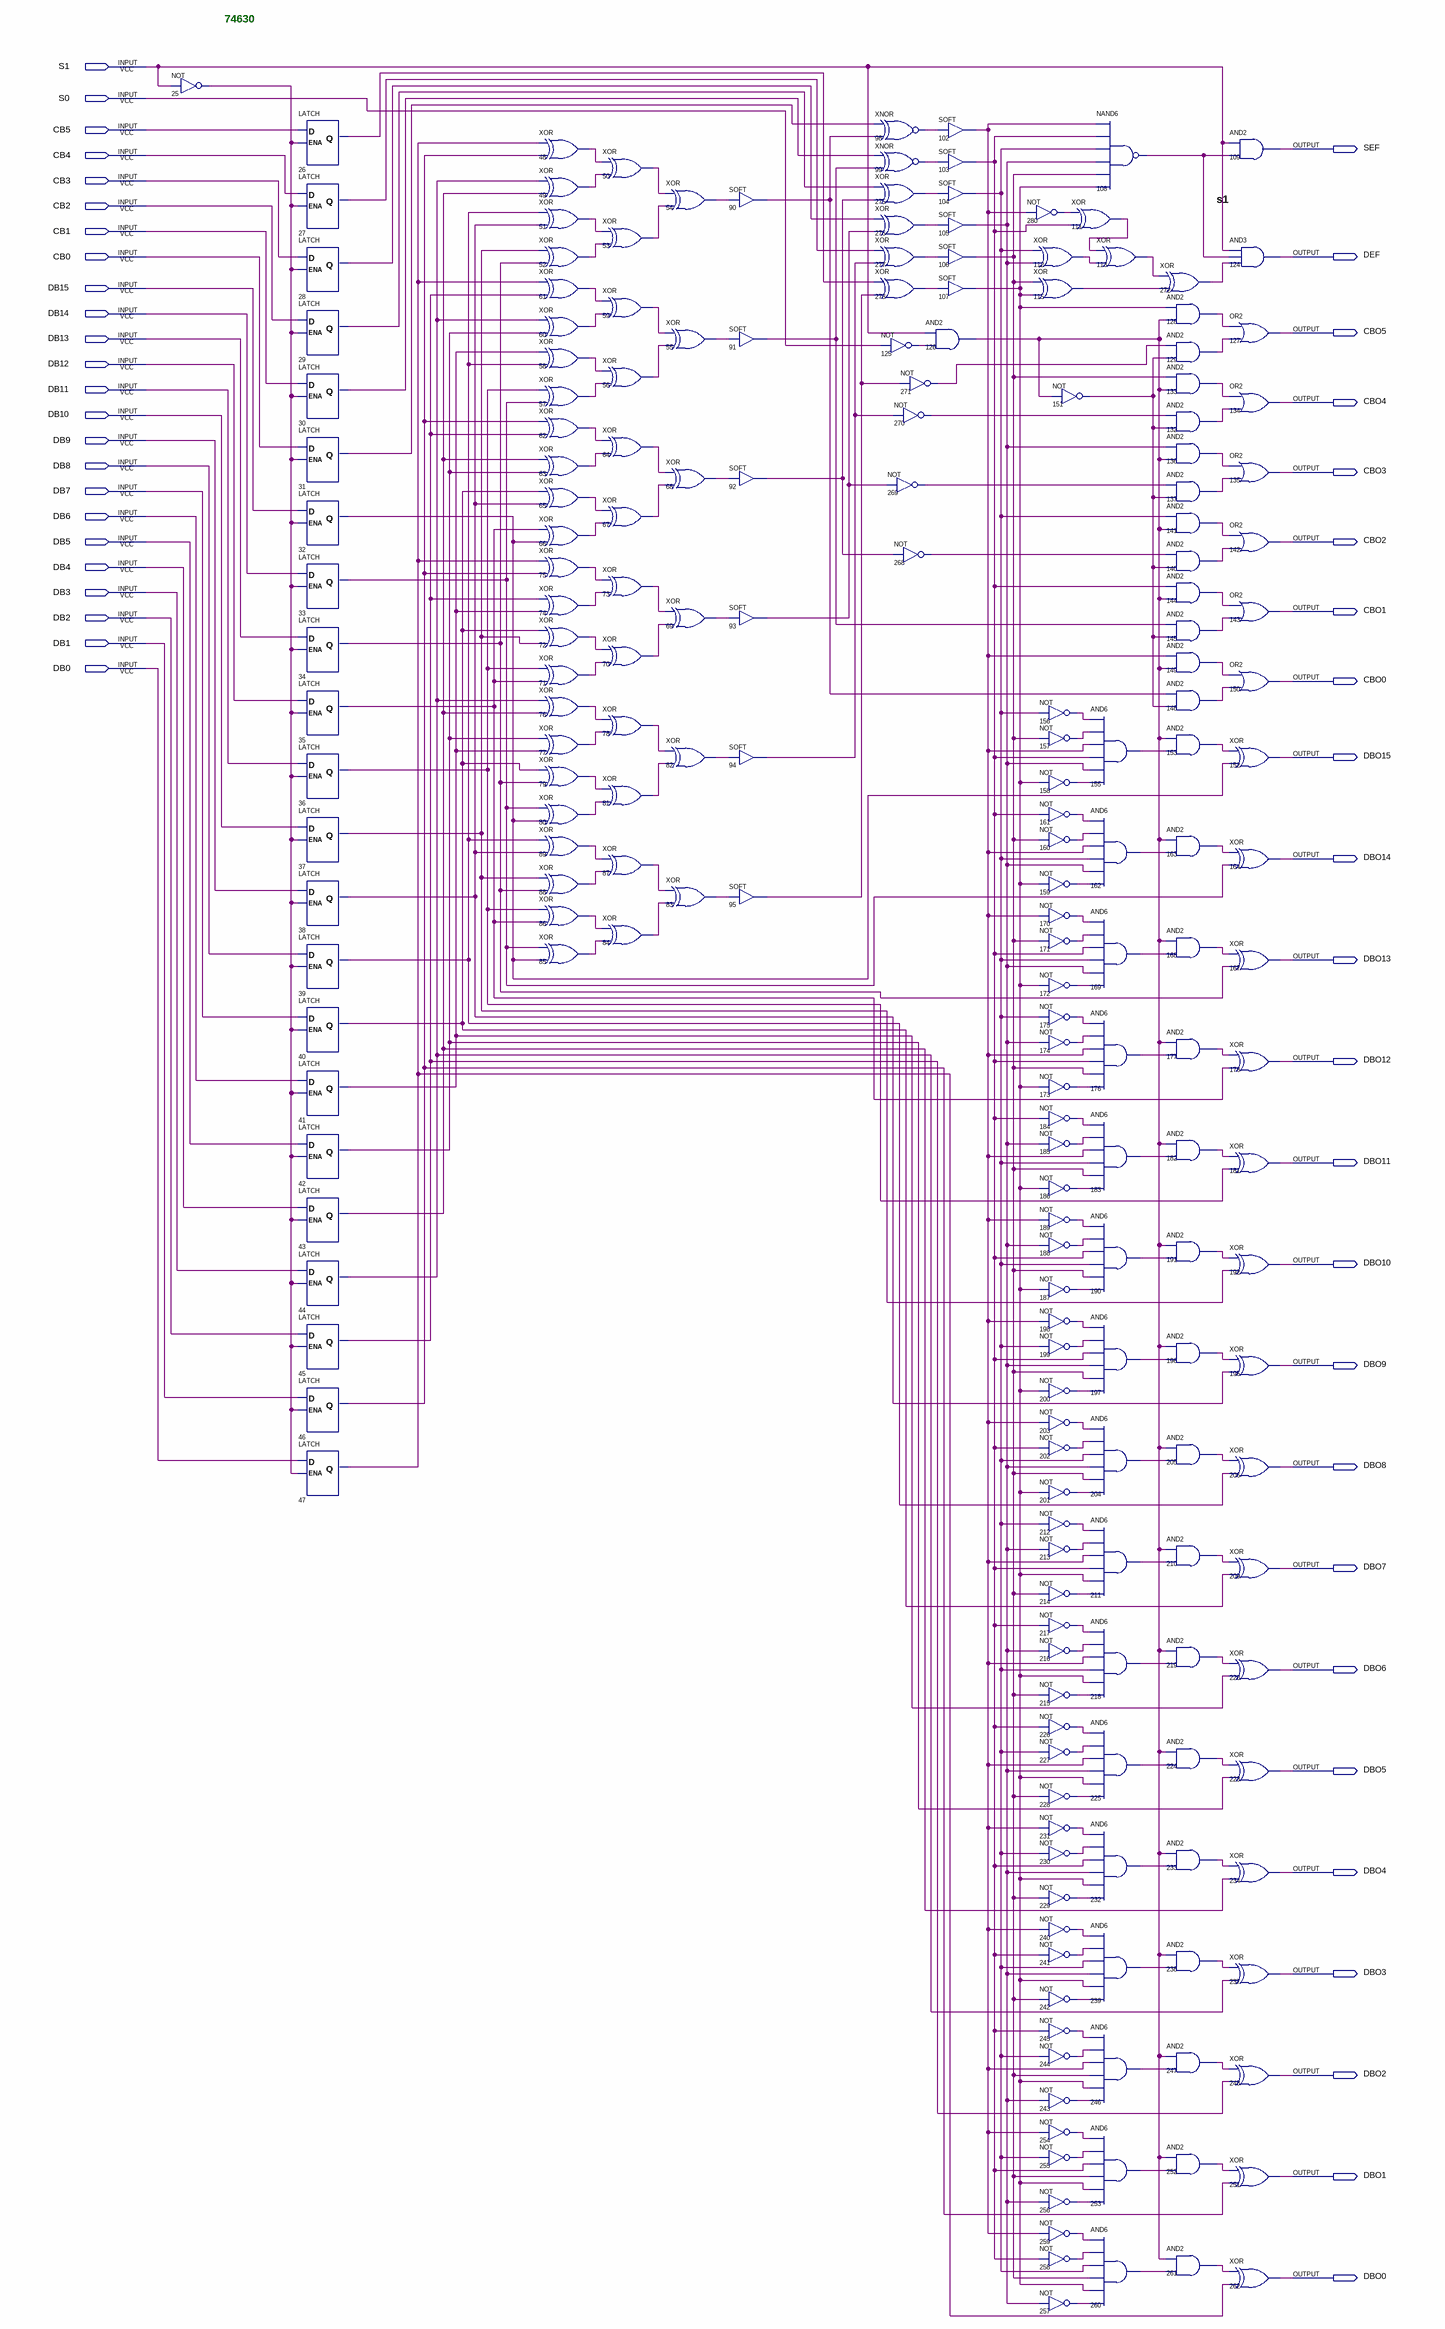
[diagram p0: schematic sheet]
// Quartus schematic 74630.bdf as structural Verilog: 213 symbols, 48 pins
module \74630  (
  input  S1,
  input  S0,
  input  CB5,
  input  CB4,
  input  CB3,
  input  CB2,
  input  CB1,
  input  CB0,
  input  DB15,
  input  DB14,
  input  DB13,
  input  DB12,
  input  DB11,
  input  DB10,
  input  DB9,
  input  DB8,
  input  DB7,
  input  DB6,
  input  DB5,
  input  DB4,
  input  DB3,
  input  DB2,
  input  DB1,
  input  DB0,
  output SEF,
  output DEF,
  output CBO5,
  output CBO4,
  output CBO3,
  output CBO2,
  output CBO1,
  output CBO0,
  output DBO15,
  output DBO14,
  output DBO13,
  output DBO12,
  output DBO11,
  output DBO10,
  output DBO9,
  output DBO8,
  output DBO7,
  output DBO6,
  output DBO5,
  output DBO4,
  output DBO3,
  output DBO2,
  output DBO1,
  output DBO0
);

  wire n25_out, n26_q, n27_q, n28_q, n29_q, n30_q, n31_q, n32_q, n33_q, n34_q, n35_q, n36_q, n37_q, n38_q,
       n39_q, n40_q, n41_q, n42_q, n43_q, n44_q, n45_q, n46_q, n47_q, n48_out, n49_out, n50_out, n51_out,
       n52_out, n53_out, n54_out, n55_out, n56_out, n57_out, n58_out, n59_out, n60_out, n61_out, n62_out,
       n63_out, n64_out, n65_out, n66_out, n67_out, n68_out, n69_out, n70_out, n71_out, n72_out, n73_out,
       n74_out, n75_out, n76_out, n77_out, n78_out, n79_out, n80_out, n81_out, n82_out, n83_out, n84_out,
       n85_out, n86_out, n87_out, n88_out, n89_out, n90_out, n91_out, n92_out, n93_out, n94_out, n95_out,
       n98_out, n99_out, n102_out, n103_out, n104_out, n105_out, n106_out, n107_out, n108_out, n111_out,
       n112_out, n113_out, n115_out, n125_out, n126_out, n128_out, n129_out, n132_out, n133_out, n136_out,
       n137_out, n140_out, n141_out, n144_out, n145_out, n148_out, n149_out, n151_out, n153_out, n155_out,
       n156_out, n157_out, n158_out, n159_out, n160_out, n161_out, n162_out, n163_out, n168_out, n169_out,
       n170_out, n171_out, n172_out, n173_out, n174_out, n175_out, n176_out, n177_out, n182_out, n183_out,
       n184_out, n185_out, n186_out, n187_out, n188_out, n189_out, n190_out, n191_out, n196_out, n197_out,
       n198_out, n199_out, n200_out, n201_out, n202_out, n203_out, n204_out, n205_out, n210_out, n211_out,
       n212_out, n213_out, n214_out, n215_out, n216_out, n217_out, n218_out, n219_out, n224_out, n225_out,
       n226_out, n227_out, n228_out, n229_out, n230_out, n231_out, n232_out, n233_out, n238_out, n239_out,
       n240_out, n241_out, n242_out, n243_out, n244_out, n245_out, n246_out, n247_out, n252_out, n253_out,
       n254_out, n255_out, n256_out, n257_out, n258_out, n259_out, n260_out, n261_out, n268_out, n269_out,
       n270_out, n271_out, n272_out, n275_out, n276_out, n277_out, n278_out, n280_out;

  not u_25 (n25_out, S1);
  LATCH u_26 (.D(CB5), .ENA(n25_out), .Q(n26_q));
  LATCH u_27 (.D(CB4), .ENA(n25_out), .Q(n27_q));
  LATCH u_28 (.D(CB3), .ENA(n25_out), .Q(n28_q));
  LATCH u_29 (.D(CB2), .ENA(n25_out), .Q(n29_q));
  LATCH u_30 (.D(CB1), .ENA(n25_out), .Q(n30_q));
  LATCH u_31 (.D(CB0), .ENA(n25_out), .Q(n31_q));
  LATCH u_32 (.D(DB15), .ENA(n25_out), .Q(n32_q));
  LATCH u_33 (.D(DB14), .ENA(n25_out), .Q(n33_q));
  LATCH u_34 (.D(DB13), .ENA(n25_out), .Q(n34_q));
  LATCH u_35 (.D(DB12), .ENA(n25_out), .Q(n35_q));
  LATCH u_36 (.D(DB11), .ENA(n25_out), .Q(n36_q));
  LATCH u_37 (.D(DB10), .ENA(n25_out), .Q(n37_q));
  LATCH u_38 (.D(DB9), .ENA(n25_out), .Q(n38_q));
  LATCH u_39 (.D(DB8), .ENA(n25_out), .Q(n39_q));
  LATCH u_40 (.D(DB7), .ENA(n25_out), .Q(n40_q));
  LATCH u_41 (.D(DB6), .ENA(n25_out), .Q(n41_q));
  LATCH u_42 (.D(DB5), .ENA(n25_out), .Q(n42_q));
  LATCH u_43 (.D(DB4), .ENA(n25_out), .Q(n43_q));
  LATCH u_44 (.D(DB3), .ENA(n25_out), .Q(n44_q));
  LATCH u_45 (.D(DB2), .ENA(n25_out), .Q(n45_q));
  LATCH u_46 (.D(DB1), .ENA(n25_out), .Q(n46_q));
  LATCH u_47 (.D(DB0), .ENA(n25_out), .Q(n47_q));
  xor u_48 (n48_out, n47_q, n46_q);
  xor u_49 (n49_out, n44_q, n43_q);
  xor u_51 (n51_out, n39_q, n38_q);
  xor u_52 (n52_out, n37_q, n34_q);
  xor u_61 (n61_out, n47_q, n45_q);
  xor u_60 (n60_out, n44_q, n42_q);
  xor u_58 (n58_out, n41_q, n39_q);
  xor u_57 (n57_out, n36_q, n33_q);
  xor u_62 (n62_out, n46_q, n45_q);
  xor u_63 (n63_out, n43_q, n42_q);
  xor u_65 (n65_out, n40_q, n38_q);
  xor u_66 (n66_out, n35_q, n32_q);
  xor u_75 (n75_out, n47_q, n46_q);
  xor u_74 (n74_out, n45_q, n41_q);
  xor u_72 (n72_out, n40_q, n37_q);
  xor u_71 (n71_out, n36_q, n35_q);
  xor u_76 (n76_out, n44_q, n43_q);
  xor u_77 (n77_out, n42_q, n41_q);
  xor u_79 (n79_out, n40_q, n34_q);
  xor u_80 (n80_out, n33_q, n32_q);
  xor u_89 (n89_out, n39_q, n38_q);
  xor u_88 (n88_out, n37_q, n34_q);
  xor u_86 (n86_out, n36_q, n35_q);
  xor u_85 (n85_out, n33_q, n32_q);
  xor u_50 (n50_out, n48_out, n49_out);
  xor u_53 (n53_out, n51_out, n52_out);
  xor u_59 (n59_out, n61_out, n60_out);
  xor u_56 (n56_out, n58_out, n57_out);
  xor u_64 (n64_out, n62_out, n63_out);
  xor u_67 (n67_out, n65_out, n66_out);
  xor u_73 (n73_out, n75_out, n74_out);
  xor u_70 (n70_out, n72_out, n71_out);
  xor u_78 (n78_out, n76_out, n77_out);
  xor u_81 (n81_out, n79_out, n80_out);
  xor u_87 (n87_out, n89_out, n88_out);
  xor u_84 (n84_out, n86_out, n85_out);
  xor u_54 (n54_out, n50_out, n53_out);
  xor u_55 (n55_out, n59_out, n56_out);
  xor u_68 (n68_out, n64_out, n67_out);
  xor u_69 (n69_out, n73_out, n70_out);
  xor u_82 (n82_out, n78_out, n81_out);
  xor u_83 (n83_out, n87_out, n84_out);
  SOFT u_90 (.IN(n54_out), .OUT(n90_out));
  SOFT u_91 (.IN(n55_out), .OUT(n91_out));
  SOFT u_92 (.IN(n68_out), .OUT(n92_out));
  SOFT u_93 (.IN(n69_out), .OUT(n93_out));
  SOFT u_94 (.IN(n82_out), .OUT(n94_out));
  SOFT u_95 (.IN(n83_out), .OUT(n95_out));
  xnor u_98 (n98_out, n31_q, n90_out);
  xnor u_99 (n99_out, n30_q, n91_out);
  xor u_275 (n275_out, n29_q, n92_out);
  xor u_276 (n276_out, n28_q, n93_out);
  xor u_277 (n277_out, n27_q, n94_out);
  xor u_278 (n278_out, n26_q, n95_out);
  not u_125 (n125_out, S0);
  not u_271 (n271_out, n95_out);
  not u_270 (n270_out, n94_out);
  not u_269 (n269_out, n93_out);
  not u_268 (n268_out, n92_out);
  SOFT u_102 (.IN(n98_out), .OUT(n102_out));
  SOFT u_103 (.IN(n99_out), .OUT(n103_out));
  SOFT u_104 (.IN(n275_out), .OUT(n104_out));
  SOFT u_105 (.IN(n276_out), .OUT(n105_out));
  SOFT u_106 (.IN(n277_out), .OUT(n106_out));
  SOFT u_107 (.IN(n278_out), .OUT(n107_out));
  and u_126 (n126_out, S1, n125_out);
  not u_280 (n280_out, n102_out);
  xor u_112 (n112_out, n104_out, n105_out);
  xor u_115 (n115_out, n106_out, n107_out);
  not u_151 (n151_out, n126_out);
  not u_156 (n156_out, n104_out);
  not u_157 (n157_out, n106_out);
  not u_158 (n158_out, n107_out);
  not u_161 (n161_out, n103_out);
  not u_160 (n160_out, n106_out);
  not u_159 (n159_out, n107_out);
  not u_170 (n170_out, n102_out);
  not u_171 (n171_out, n106_out);
  not u_172 (n172_out, n107_out);
  not u_175 (n175_out, n104_out);
  not u_174 (n174_out, n105_out);
  not u_173 (n173_out, n107_out);
  not u_184 (n184_out, n103_out);
  not u_185 (n185_out, n105_out);
  not u_186 (n186_out, n107_out);
  not u_189 (n189_out, n102_out);
  not u_188 (n188_out, n105_out);
  not u_187 (n187_out, n107_out);
  not u_198 (n198_out, n102_out);
  not u_199 (n199_out, n104_out);
  not u_200 (n200_out, n107_out);
  not u_203 (n203_out, n102_out);
  not u_202 (n202_out, n103_out);
  not u_201 (n201_out, n107_out);
  not u_212 (n212_out, n104_out);
  not u_213 (n213_out, n105_out);
  not u_214 (n214_out, n106_out);
  not u_217 (n217_out, n103_out);
  not u_216 (n216_out, n105_out);
  not u_215 (n215_out, n106_out);
  not u_226 (n226_out, n103_out);
  not u_227 (n227_out, n104_out);
  not u_228 (n228_out, n106_out);
  not u_231 (n231_out, n102_out);
  not u_230 (n230_out, n104_out);
  not u_229 (n229_out, n106_out);
  not u_240 (n240_out, n102_out);
  not u_241 (n241_out, n103_out);
  not u_242 (n242_out, n106_out);
  not u_245 (n245_out, n103_out);
  not u_244 (n244_out, n104_out);
  not u_243 (n243_out, n105_out);
  not u_254 (n254_out, n102_out);
  not u_255 (n255_out, n104_out);
  not u_256 (n256_out, n105_out);
  not u_259 (n259_out, n102_out);
  not u_258 (n258_out, n103_out);
  not u_257 (n257_out, n105_out);
  nand u_108 (n108_out, n102_out, n103_out, n104_out, n105_out, n106_out, n107_out);
  xor u_111 (n111_out, n280_out, n103_out);
  xor u_113 (n113_out, n111_out, n112_out);
  and u_155 (n155_out, n156_out, n157_out, n102_out, n103_out, n105_out, n158_out);
  and u_162 (n162_out, n161_out, n160_out, n102_out, n104_out, n105_out, n159_out);
  and u_169 (n169_out, n170_out, n171_out, n103_out, n104_out, n105_out, n172_out);
  and u_176 (n176_out, n175_out, n174_out, n102_out, n103_out, n106_out, n173_out);
  and u_183 (n183_out, n184_out, n185_out, n102_out, n104_out, n106_out, n186_out);
  and u_190 (n190_out, n189_out, n188_out, n103_out, n104_out, n106_out, n187_out);
  and u_197 (n197_out, n198_out, n199_out, n103_out, n105_out, n106_out, n200_out);
  and u_204 (n204_out, n203_out, n202_out, n104_out, n105_out, n106_out, n201_out);
  and u_211 (n211_out, n212_out, n213_out, n102_out, n103_out, n107_out, n214_out);
  and u_218 (n218_out, n217_out, n216_out, n102_out, n104_out, n107_out, n215_out);
  and u_225 (n225_out, n226_out, n227_out, n102_out, n105_out, n107_out, n228_out);
  and u_232 (n232_out, n231_out, n230_out, n103_out, n105_out, n107_out, n229_out);
  and u_239 (n239_out, n240_out, n241_out, n104_out, n105_out, n107_out, n242_out);
  and u_246 (n246_out, n245_out, n244_out, n102_out, n106_out, n107_out, n243_out);
  and u_253 (n253_out, n254_out, n255_out, n103_out, n106_out, n107_out, n256_out);
  and u_260 (n260_out, n259_out, n258_out, n104_out, n106_out, n107_out, n257_out);
  xor u_272 (n272_out, n113_out, n115_out);
  and u_128 (n128_out, n107_out, n126_out);
  and u_129 (n129_out, n271_out, n151_out);
  and u_133 (n133_out, n106_out, n126_out);
  and u_132 (n132_out, n270_out, n151_out);
  and u_136 (n136_out, n105_out, n126_out);
  and u_137 (n137_out, n269_out, n151_out);
  and u_141 (n141_out, n104_out, n126_out);
  and u_140 (n140_out, n268_out, n151_out);
  and u_144 (n144_out, n103_out, n126_out);
  and u_145 (n145_out, n91_out, n151_out);
  and u_149 (n149_out, n102_out, n126_out);
  and u_148 (n148_out, n90_out, n151_out);
  and u_153 (n153_out, n126_out, n155_out);
  and u_163 (n163_out, n126_out, n162_out);
  and u_168 (n168_out, n126_out, n169_out);
  and u_177 (n177_out, n126_out, n176_out);
  and u_182 (n182_out, n126_out, n183_out);
  and u_191 (n191_out, n126_out, n190_out);
  and u_196 (n196_out, n126_out, n197_out);
  and u_205 (n205_out, n126_out, n204_out);
  and u_210 (n210_out, n126_out, n211_out);
  and u_219 (n219_out, n126_out, n218_out);
  and u_224 (n224_out, n126_out, n225_out);
  and u_233 (n233_out, n126_out, n232_out);
  and u_238 (n238_out, n126_out, n239_out);
  and u_247 (n247_out, n126_out, n246_out);
  and u_252 (n252_out, n126_out, n253_out);
  and u_261 (n261_out, n126_out, n260_out);
  and u_109 (SEF, S1, n108_out);
  and u_124 (DEF, S1, n108_out, n272_out);
  or u_127 (CBO5, n128_out, n129_out);
  or u_134 (CBO4, n133_out, n132_out);
  or u_135 (CBO3, n136_out, n137_out);
  or u_142 (CBO2, n141_out, n140_out);
  or u_143 (CBO1, n144_out, n145_out);
  or u_150 (CBO0, n149_out, n148_out);
  xor u_152 (DBO15, n153_out, n32_q);
  xor u_164 (DBO14, n163_out, n33_q);
  xor u_167 (DBO13, n168_out, n34_q);
  xor u_178 (DBO12, n177_out, n35_q);
  xor u_181 (DBO11, n182_out, n36_q);
  xor u_192 (DBO10, n191_out, n37_q);
  xor u_195 (DBO9, n196_out, n38_q);
  xor u_206 (DBO8, n205_out, n39_q);
  xor u_209 (DBO7, n210_out, n40_q);
  xor u_220 (DBO6, n219_out, n41_q);
  xor u_223 (DBO5, n224_out, n42_q);
  xor u_234 (DBO4, n233_out, n43_q);
  xor u_237 (DBO3, n238_out, n44_q);
  xor u_248 (DBO2, n247_out, n45_q);
  xor u_251 (DBO1, n252_out, n46_q);
  xor u_262 (DBO0, n261_out, n47_q);

  // Notes on the sheet:
  //   74630
endmodule
